# EAGLE design HB-Dis-EP-42BW (EAGLE 9.4.2)
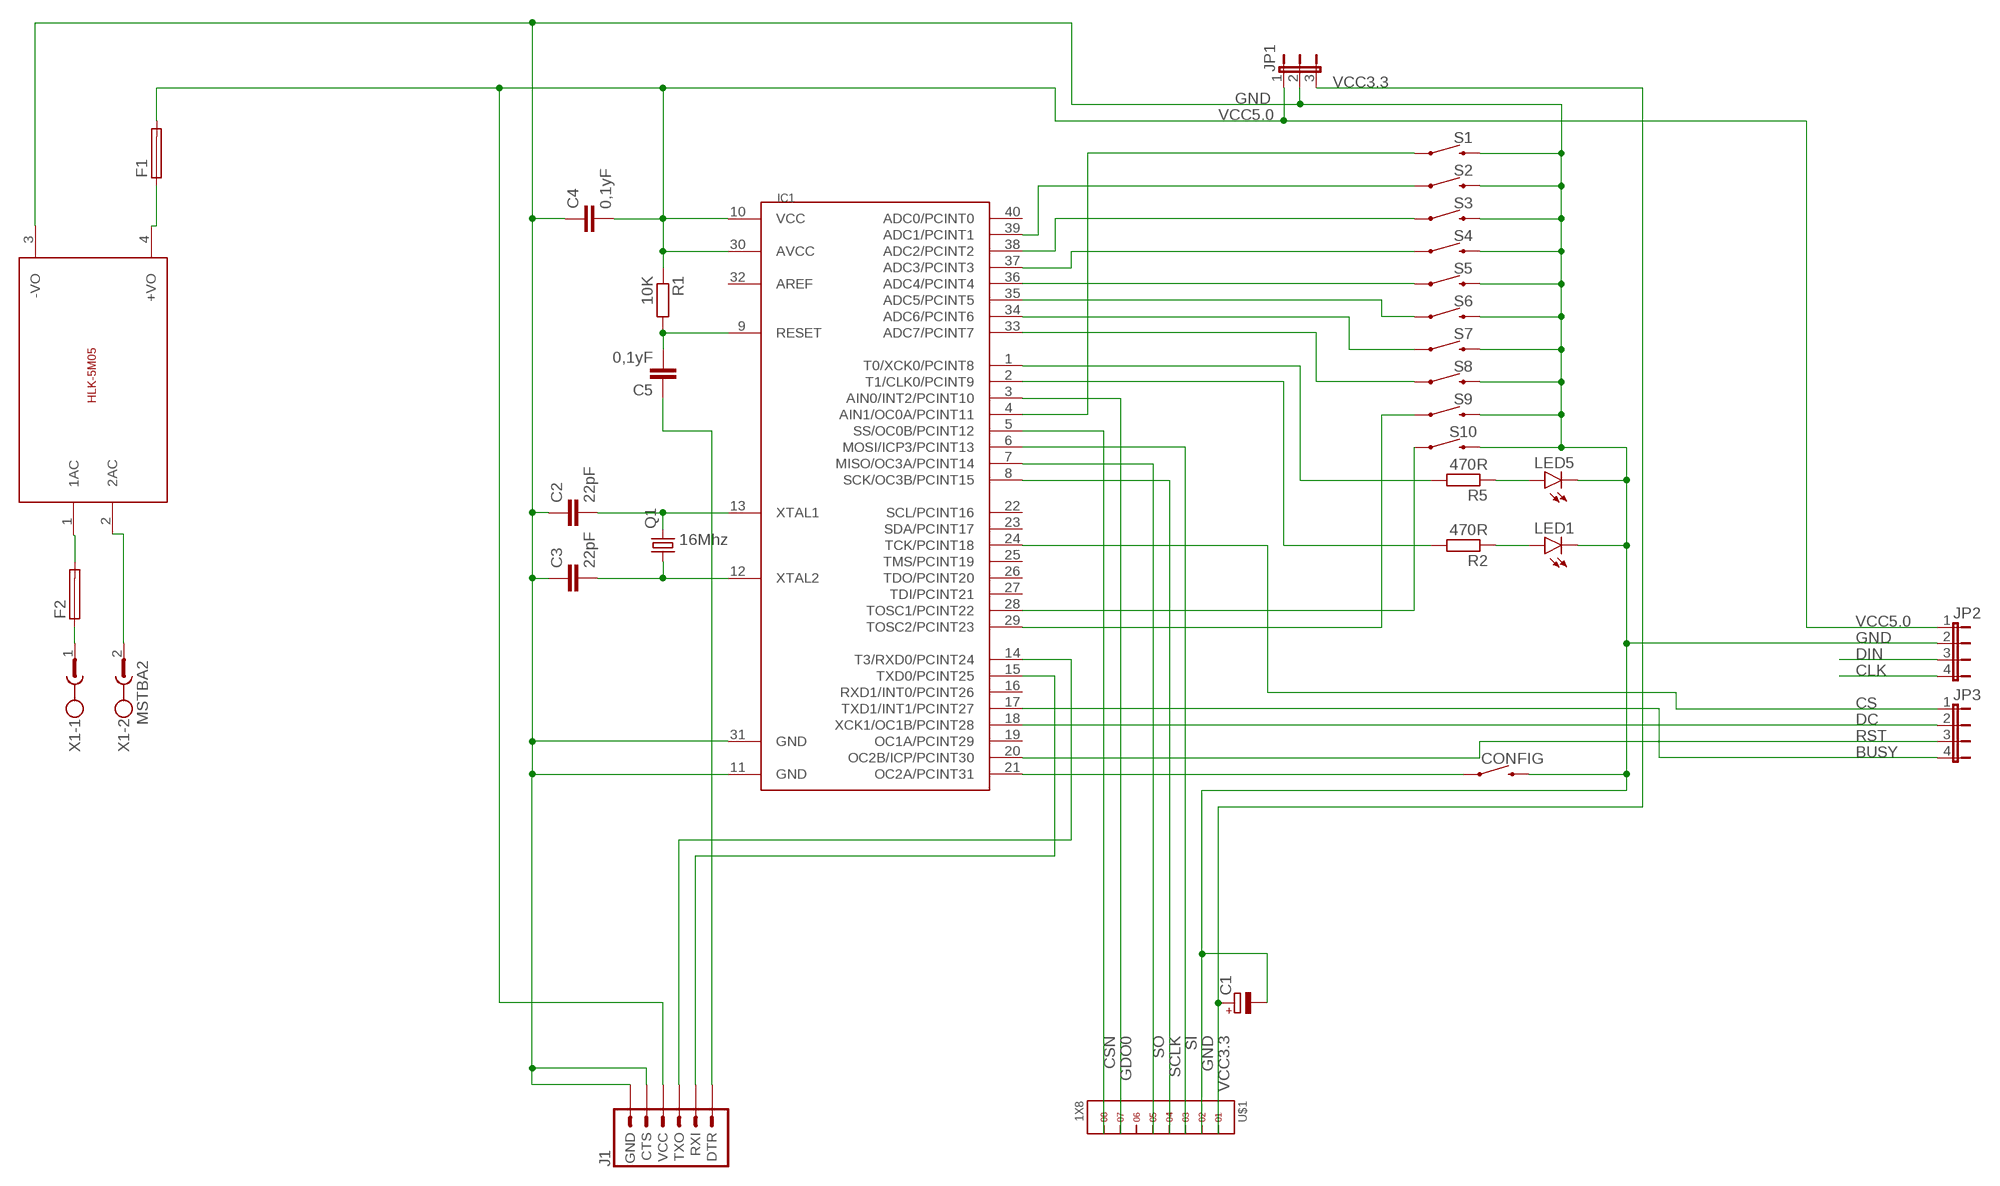
[diagram p0: schematic, sheet 1]

## Parts
C1  CPOL-EUE2.5-5  [E2,5-5]
C2  22pF  C-EU025-024X044  [C025-024X044]
C3  22pF  C-EU025-024X044  [C025-024X044]
C4  0,1yF  C-EU025-024X044  [C025-024X044]
C5  0,1yF  C-EU025-024X044  [C025-024X044]
CONFIG  MOMENTARY-SWITCH-SPST-PTH-6.0MM-KIT  [TACTILE_SWITCH_PTH_6.0MM_KIT]
F1  SH22,5A  [SH22,5A]
F2  SH22,5A  [SH22,5A]
IC1  MEGA1284P  [DIL40]
J1  6_PIN_SERIAL_TARGETLONGPADS  [1X06_LONGPADS]
JP1  JP2E  [JP2]
JP2  JP4E  [JP4]
JP3  JP4E  [JP4]
LED1  LED3MM  [LED3MM]
LED5  LED3MM  [LED3MM]
Q1  16Mhz  CRYSTALHC49U-V  [HC49U-V]
R1  10K  R-EU_0309/10  [0309/10]
R2  470R  R-EU_0309/10  [0309/10]
R5  470R  R-EU_0309/10  [0309/10]
S1  MOMENTARY-SWITCH-SPST-PTH-6.0MM-KIT  [TACTILE_SWITCH_PTH_6.0MM_KIT]
S2  MOMENTARY-SWITCH-SPST-PTH-6.0MM-KIT  [TACTILE_SWITCH_PTH_6.0MM_KIT]
S3  MOMENTARY-SWITCH-SPST-PTH-6.0MM-KIT  [TACTILE_SWITCH_PTH_6.0MM_KIT]
S4  MOMENTARY-SWITCH-SPST-PTH-6.0MM-KIT  [TACTILE_SWITCH_PTH_6.0MM_KIT]
S5  MOMENTARY-SWITCH-SPST-PTH-6.0MM-KIT  [TACTILE_SWITCH_PTH_6.0MM_KIT]
S6  MOMENTARY-SWITCH-SPST-PTH-6.0MM-KIT  [TACTILE_SWITCH_PTH_6.0MM_KIT]
S7  MOMENTARY-SWITCH-SPST-PTH-6.0MM-KIT  [TACTILE_SWITCH_PTH_6.0MM_KIT]
S8  MOMENTARY-SWITCH-SPST-PTH-6.0MM-KIT  [TACTILE_SWITCH_PTH_6.0MM_KIT]
S9  MOMENTARY-SWITCH-SPST-PTH-6.0MM-KIT  [TACTILE_SWITCH_PTH_6.0MM_KIT]
S10  MOMENTARY-SWITCH-SPST-PTH-6.0MM-KIT  [TACTILE_SWITCH_PTH_6.0MM_KIT]
U$1  1X8  [1X8]
U$3  5VDC/5W  HLK-5M05  [HLK-5M05]
X1  MSTBA2  [MSTBA2]

## Nets
BUSY: IC1.17(TXD1/INT1/PCINT27) JP3.4
CLK: JP2.4
CS: IC1.24(TCK/PCINT18) JP3.1
CSN: IC1.5(SS/OC0B/PCINT12) U$1.8
DC: IC1.18(XCK1/OC1B/PCINT28) JP3.2
DIN: JP2.3
GDO0: IC1.3(AIN0/INT2/PCINT10) U$1.7
GND: C1.- C2.1 C3.1 C4.1 CONFIG.3 IC1.11(GND) IC1.31(GND) J1.5(CTS) J1.6(GND) JP1.2 JP2.2 LED1.K(C) LED5.K(C) S1.3 S2.3 S3.3 S4.3 S5.3 S6.3 S7.3 S8.3 S9.3 S10.3 U$1.2 U$3.3(-VO)
N$1: C2.2 IC1.13(XTAL1) Q1.2
N$2: C3.2 IC1.12(XTAL2) Q1.1
N$3: C5.1 J1.1(DTR)
N$4: LED1.A R2.1
N$5: F2.1 X1.1
N$6: U$3.2(2AC) X1.2
N$7: F2.2 U$3.1(1AC)
N$8: F1.1 U$3.4(+VO)
N$9: C5.2 IC1.9(RESET) R1.2
N$10: IC1.15(TXD0/PCINT25) J1.2(RXI)
N$11: LED5.A R5.1
N$12: IC1.4(AIN1/OC0A/PCINT11) S1.1
N$13: IC1.14(T3/RXD0/PCINT24) J1.3(TXO)
N$19: IC1.39(ADC1/PCINT1) S2.1
N$20: IC1.38(ADC2/PCINT2) S3.1
N$21: IC1.37(ADC3/PCINT3) S4.1
N$22: IC1.36(ADC4/PCINT4) S5.1
N$23: IC1.35(ADC5/PCINT5) S6.1
N$24: IC1.34(ADC6/PCINT6) S7.1
N$25: IC1.33(ADC7/PCINT7) S8.1
N$26: IC1.28(TOSC1/PCINT22) S10.1
N$27: IC1.29(TOSC2/PCINT23) S9.1
N$28: CONFIG.1 IC1.21(OC2A/PCINT31)
N$29: IC1.1(T0/XCK0/PCINT8) R5.2
N$30: IC1.2(T1/CLK0/PCINT9) R2.2
RST: IC1.20(OC2B/ICP/PCINT30) JP3.3
SCLK: IC1.8(SCK/OC3B/PCINT15) U$1.4
SI: IC1.6(MOSI/ICP3/PCINT13) U$1.3
SO: IC1.7(MISO/OC3A/PCINT14) U$1.5
VCC3.3: C1.+ JP1.3 U$1.1
VCC5.0: C4.2 F1.2 IC1.10(VCC) IC1.30(AVCC) J1.4(VCC) JP1.1 JP2.1 R1.1
Unconnected: IC1.16(RXD1/INT0/PCINT26) IC1.19(OC1A/PCINT29) IC1.22(SCL/PCINT16) IC1.23(SDA/PCINT17) IC1.25(TMS/PCINT19) IC1.26(TDO/PCINT20) IC1.27(TDI/PCINT21) IC1.32(AREF) IC1.40(ADC0/PCINT0) U$1.6

## Library data of the parts
C1 = resistor:CPOL-EU: POLARIZED CAPACITOR, European symbol
C2-C5 = resistor:C-EU: CAPACITOR, European symbol
CONFIG S1-S10 = SparkFun-Switches:MOMENTARY-SWITCH-SPST: Momentary Switch (Pushbutton) - SPST Normally-open (NO) SPST momentary switches (buttons, pushbuttons). Variants PTH-12MM - 12mm square, through-hole Momentary Pushbutton Switch - 12mm Square <https://www.sparkfun.com/products/9190> (COM-09190) PTH-6.0MM, PTH-6.0MM-KIT - 6.0mm square, through-hole Mini Pushbutton Switch <https://www.sparkfun.com/products/97> (COM-00097) KIT package intended for soldering kit's - only one side of pads' copper is exposed. PTH-RIGHT-ANGLE-KIT - Right-angle, through-hole Right Angle Tactile Button <https://www.sparkfun.com/products/10791> - Used on SparkFun BigTime Watch Kit <https://www.sparkfun.com/products/11734> SMD-12MM - 12mm square, surface-mount Tactile Button - SMD (12mm) <https://www.sparkfun.com/products/12993> (COM-12993) Used on SparkFun PicoBoard <https://www.sparkfun.com/products/11888> SMD-4.5MM - 4.5mm Square Trackball Switch Used on SparkFun Blackberry Trackballer Breakout <https://www.sparkfun.com/products/13169> SMD-4.6MMX2.8MM - 4.60mm x 2.80mm, surface mount Used on SparkFun SAMD21 Mini Breakout <https://www.sparkfun.com/products/13664> SMD-5.2MM, SMD-5.2-REDUNDANT - 5.2mm square, surface-mount Mini Pushbutton Switch - SMD <https://www.sparkfun.com/products/8720> (COM-08720) Used on Arduino Pro Mini <https://www.sparkfun.com/products/11114> REDUNDANT package connects both switch circuits together SMD-6.0X3.5MM - 6.0 x 3.5mm, surface mount Momentary Reset Switch SMD <https://www.sparkfun.com/products/8229> (COM-08229) SMD-6.2MM-TALL - 6.2mm square, surface mount Tactile Button - SMD (6mm) <https://www.sparkfun.com/products/12992> Used on SparkFun Digital Sandbox <https://www.sparkfun.com/products/12651> SMD-RIGHT-ANGLE - Right-angle, surface mount Used on SparkFun Block for Intel® Edison - Arduino <https://www.sparkfun.com/products/13036>; PROD_ID: SWCH-08441; SF_SKU: COM-00097
F1 F2 = fuse:SH22,5A: FUSE HOLDER grid 22,5mm, isolated cap OGN0031 8201, Schurter (Buerklin); MPN: 0031.7701.11; OC_FARNELL: unknown; OC_NEWARK: 04F1224
IC1 = 1284p:MEGA1284P: Atmel ATmega1284P 8-bit AVR Microcontroller
J1 = SparkFun-Connectors:6_PIN_SERIAL_TARGET: 6-pin header connection for use with the "FTDI BASIC" pinout - TARGET SIDE. Also known as "Arduino Serial Program Header". It is used to mate with our FTDI Basic serial programmers using the Arduino IDE. Note, this device has "TARGET" in the name. It is intended to be used on a design that contains a target micro-controller that you wish to program. The "sister" device, named "CABLE" is inteneded to be used on a design that usually lives on the end of your USB cable and prvides the converter chip (FTDI232 or FTDI231x) to commnicate serial RX/TX. You can populate with some of these: Break Away Headers - Straight <https://www.sparkfun.com/products/116> (PRT-00116) For reference (or to suit your programming needs) check out these designs: SparkFun FTDI Basic Breakout - 5V <https://www.sparkfun.com/products/9716> (DEV-09716) SparkFun FTDI Basic Breakout - 3.3V <https://www.sparkfun.com/products/9873> (DEV-09873) SparkFun FTDI SmartBasic <https://www.sparkfun.com/products/12935> (DEV-12935) SparkFun Beefy 3 - FTDI Basic Breakout <https://www.sparkfun.com/products/13746> (DEV-13746)
JP1 = jumper:JP2E: JUMPER
JP2 JP3 = jumper:JP4E: JUMPER
LED1 LED5 = led:LED: LED OSRAM: - CHIPLED LG R971, LG N971, LY N971, LG Q971, LY Q971, LO R971, LY R971 LH N974, LH R974 LS Q976, LO Q976, LY Q976 LO Q996 - Hyper CHIPLED LW Q18S LB Q993, LB Q99A, LB R99A - SideLED LS A670, LO A670, LY A670, LG A670, LP A670 LB A673, LV A673, LT A673, LW A673 LH A674 LY A675 LS A676, LA A676, LO A676, LY A676, LW A676 LS A679, LY A679, LG A679 - Hyper Micro SIDELED® LS Y876, LA Y876, LO Y876, LY Y876 LT Y87S - SmartLED LW L88C, LW L88S LB L89C, LB L89S, LG L890 LS L89K, LO L89K, LY L89K LS L896, LA L896, LO L896, LY L896 - TOPLED LS T670, LO T670, LY T670, LG T670, LP T670 LSG T670, LSP T670, LSY T670, LOP T670, LYG T670 LG T671, LOG T671, LSG T671 LB T673, LV T673, LT T673, LW T673 LH T674 LS T676, LA T676, LO T676, LY T676, LB T676, LH T676, LSB T676, LW T676 LB T67C, LV T67C, LT T67C, LS T67K, LO T67K, LY T67K, LW E67C LS E67B, LA E67B, LO E67B, LY E67B, LB E67C, LV E67C, LT E67C LW T67C LS T679, LY T679, LG T679 LS T770, LO T770, LY T770, LG T770, LP T770 LB T773, LV T773, LT T773, LW T773 LH T774 LS E675, LA E675, LY E675, LS T675 LS T776, LA T776, LO T776, LY T776, LB T776 LHGB T686 LT T68C, LB T68C - Hyper Mini TOPLED® LB M676 - Mini TOPLED Santana® LG M470 LS M47K, LO M47K, LY M47K Source: http://www.osram.convergy.de LUXEON: - LUMILED® LXK2-PW12-R00, LXK2-PW12-S00, LXK2-PW14-U00, LXK2-PW14-V00 LXK2-PM12-R00, LXK2-PM12-S00, LXK2-PM14-U00 LXK2-PE12-Q00, LXK2-PE12-R00, LXK2-PE12-S00, LXK2-PE14-T00, LXK2-PE14-U00 LXK2-PB12-K00, LXK2-PB12-L00, LXK2-PB12-M00, LXK2-PB14-N00, LXK2-PB14-P00, LXK2-PB14-Q00 LXK2-PR12-L00, LXK2-PR12-M00, LXK2-PR14-Q00, LXK2-PR14-R00 LXK2-PD12-Q00, LXK2-PD12-R00, LXK2-PD12-S00 LXK2-PH12-R00, LXK2-PH12-S00 LXK2-PL12-P00, LXK2-PL12-Q00, LXK2-PL12-R00 Source: www.luxeon.com KINGBRIGHT: KA-3528ASYC Source: www.kingbright.com
Q1 = crystal:CRYSTAL: CRYSTAL; OC_FARNELL: 1666969; OC_NEWARK: unknown
R1 R2 R5 = resistor:R-EU_: RESISTOR, European symbol
U$1 = headers(2mm):1X8
U$3 = HLK-5M05:HLK-5M05: HLK-5M05 is an 5Volt/5W smps developed by HI-LINK; SIZE: 23x38(mm)
X1 = con-phoenix-508:MSTBA2: PHOENIX; MF: FARNELL; MPN: 1757242; OC_FARNELL: 3705171; OC_NEWARK: 71C4161

## Board
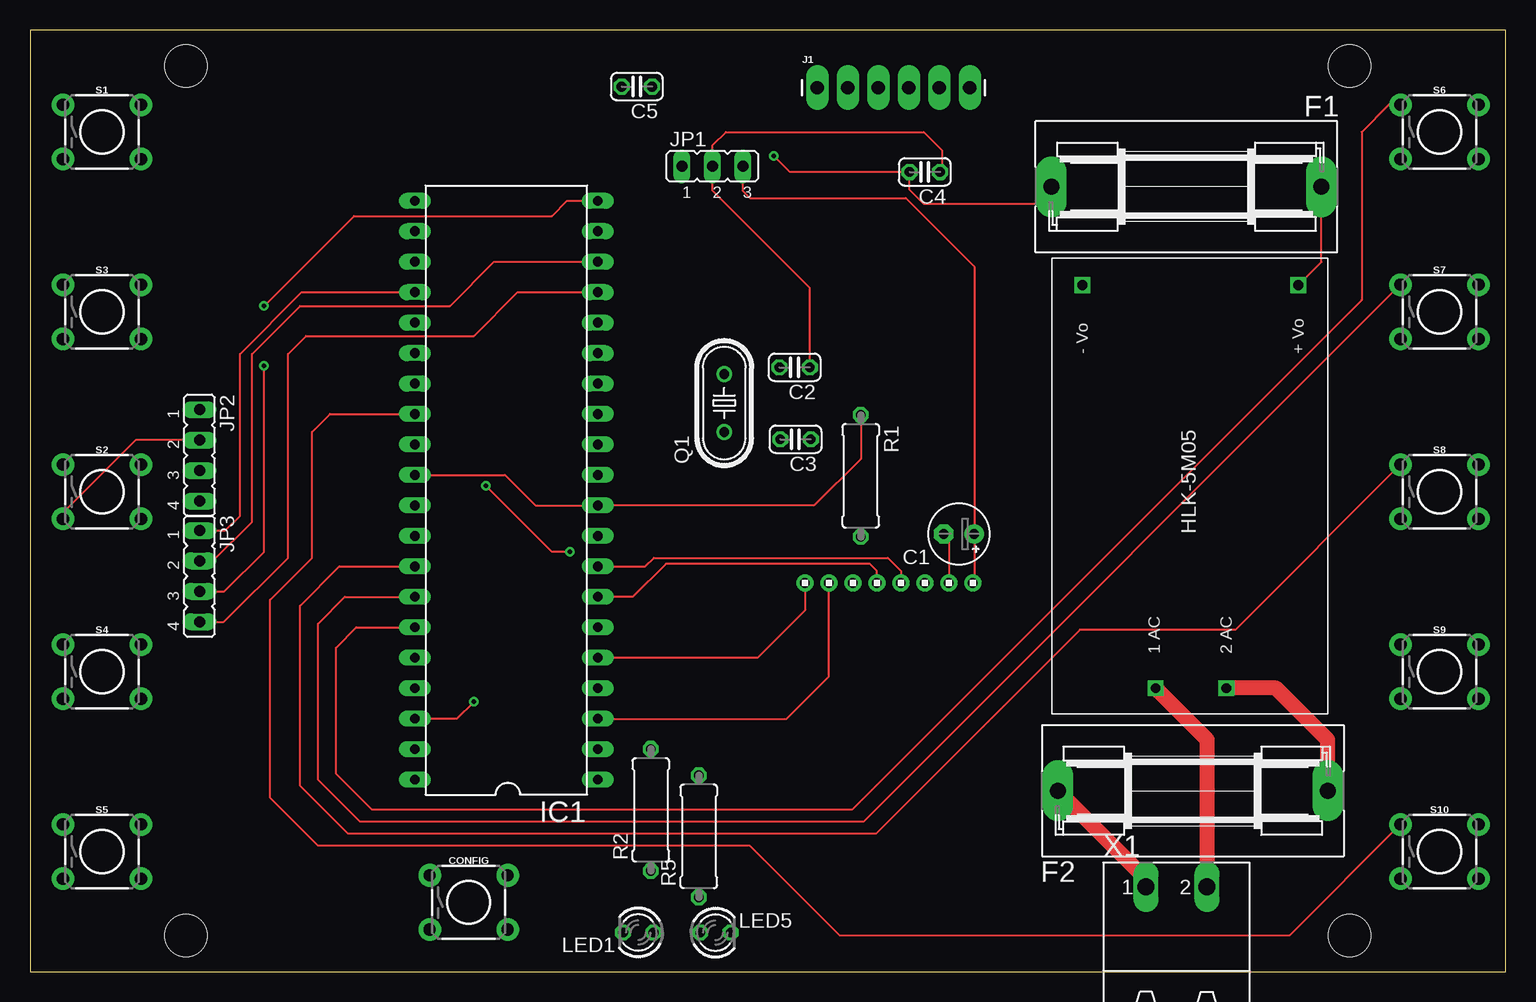
[diagram p1: board, top side]
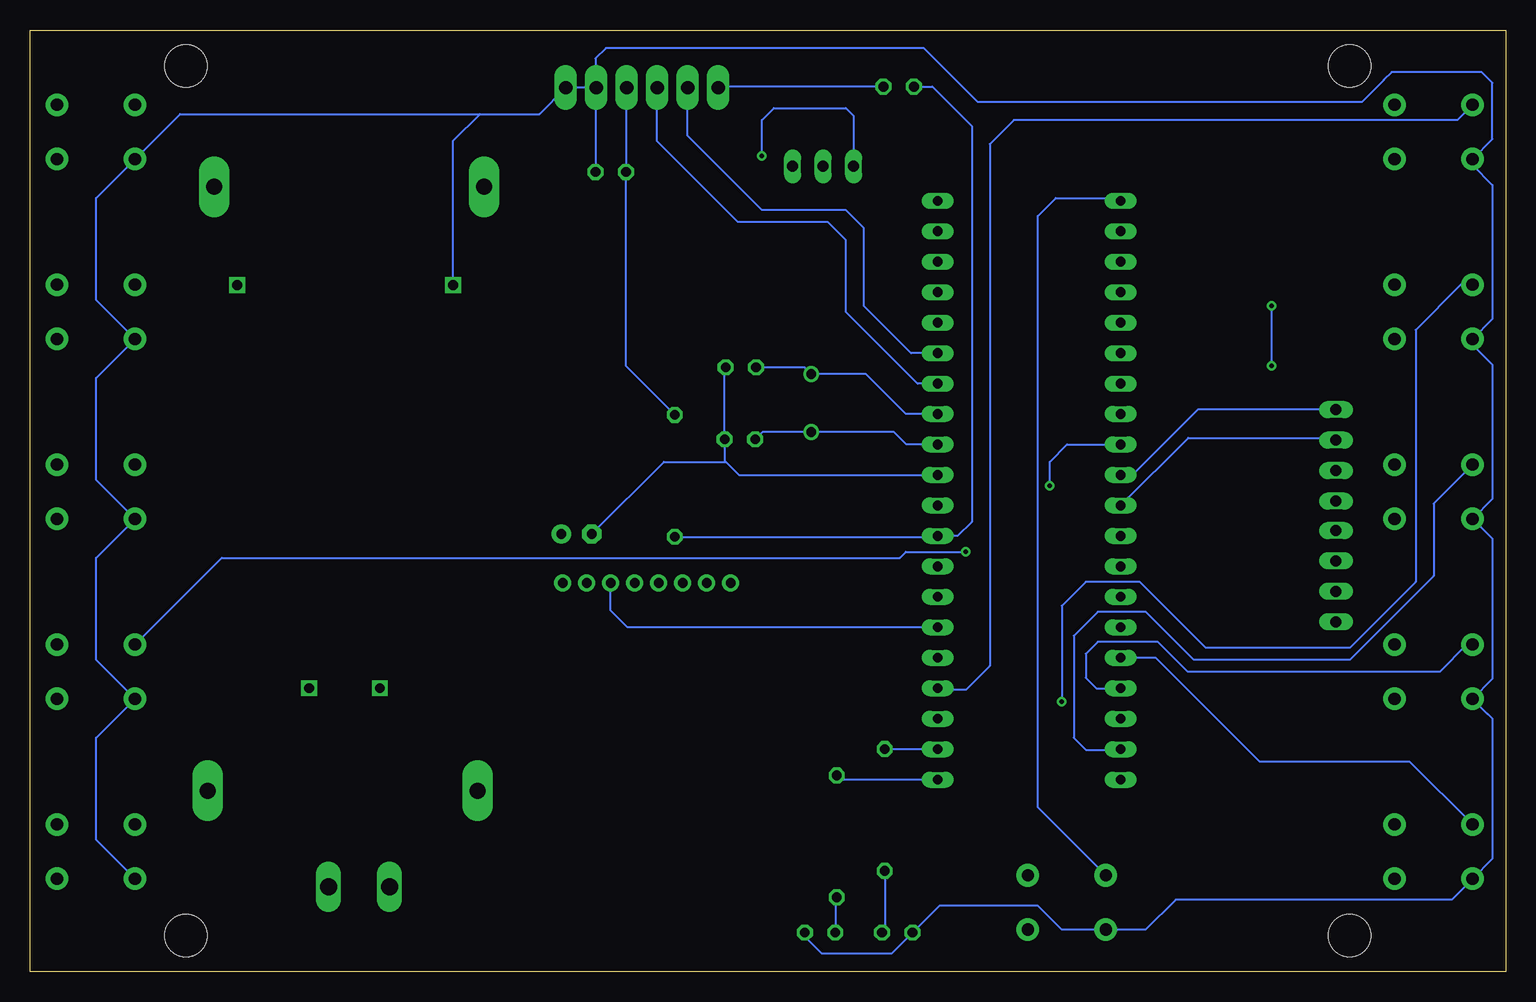
[diagram p2: board, bottom side, seen from below]

Size 123 x 78.5 mm. Coordinates in mm from the lower left corner, seen from the top.
Outline: 0,0 123,0 123,78.5 0,78.5 0,0
Copper layers (1*16): Top 0.035mm / dielectric 1.5mm / Bottom 0.035mm
Design rules "default": minimum track width 6mil, minimum drill 0.35mm, track to track 6mil, track to pad 6mil, pad to pad 6mil, via to via 6mil, smd to smd 6mil, copper to edge 40mil, drill to drill 6mil, minimum pad ring 10mil, minimum via ring 8mil, stop-mask expansion 4mil, vias tented up to drill 0mil, thermal gap 10mil
Holes 3.5 mm at 13,3 110,3 13,75.5 110,75.5

### Footprints (pad centres in the part's own frame; a part is rotated, then mirrored left to right if it is on the bottom)
E2,5-5 = drill 0.813 pad 1.6: + -1.27,0 | drill 0.813 pad 1.6 octagon: - 1.27,0
C025-024X044 = drill 0.813 octagon: 1 -1.27,0; 2 1.27,0
TACTILE_SWITCH_PTH_6.0MM_KIT = drill 1.016 pad 1.88: 1 -3.251,2.261; 2 3.251,2.261; 3 -3.251,-2.261; 4 3.251,-2.261
SH22,5A = drill 1.321 pad 2.54 long: 1 -11.252,0; 2 11.252,0
DIL40 = drill 0.813 long: 1 -24.13,-7.62; 2 -21.59,-7.62; 3 -19.05,-7.62; 4 -16.51,-7.62; 5 -13.97,-7.62; 6 -11.43,-7.62; 7 -8.89,-7.62; 8 -6.35,-7.62; 9 -3.81,-7.62; 10 -1.27,-7.62; 11 1.27,-7.62; 12 3.81,-7.62; 13 6.35,-7.62; 14 8.89,-7.62; 15 11.43,-7.62; 16 13.97,-7.62; 17 16.51,-7.62; 18 19.05,-7.62; 19 21.59,-7.62; 20 24.13,-7.62; 21 24.13,7.62; 22 21.59,7.62; 23 19.05,7.62; 24 16.51,7.62; 25 13.97,7.62; 26 11.43,7.62; 27 8.89,7.62; 28 6.35,7.62; 29 3.81,7.62; 30 1.27,7.62; 31 -1.27,7.62; 32 -3.81,7.62; 33 -6.35,7.62; 34 -8.89,7.62; 35 -11.43,7.62; 36 -13.97,7.62; 37 -16.51,7.62; 38 -19.05,7.62; 39 -21.59,7.62; 40 -24.13,7.62
1X06_LONGPADS = drill 1.118 pad 1.88 long: 1 0,0; 2 2.54,0; 3 5.08,0; 4 7.62,0; 5 10.16,0; 6 12.7,0
JP2 = drill 0.914 long: 1 -2.54,0; 2 0,0; 3 2.54,0
JP4 = drill 0.914 long: 1 -3.81,0; 2 -1.27,0; 3 1.27,0; 4 3.81,0
LED3MM = drill 0.813 octagon: A -1.27,0; K 1.27,0
HC49U-V = drill 0.813: 1 -2.413,0; 2 2.413,0
0309/10 = drill 0.813 octagon: 1 -5.08,0; 2 5.08,0
1X8 = drill 0.8 pad 1.422: 1 -7,0; 2 -5,0; 3 -3,0; 4 -1,0; 5 1,0; 6 3,0; 7 5,0; 8 7,0
HLK-5M05 = drill 0.8 square: 1 -16.85,-2.93; 2 -16.85,2.97; 3 16.75,9.07; 4 16.75,-8.93
MSTBA2 = drill 1.397 long: 1 -2.54,5.08; 2 2.54,5.08

### Placement (x,y rotation side)
C1  77.44,36.48 180 top
C2  63.74,50.37 180 top
C3  63.82,44.37 180 top
C4  74.59,66.66 180 top
C5  50.59,73.78 180 top
CONFIG  36.57,5.76 0 top
F1  96.4,65.43 180 top
F2  96.93,15.07 0 top
IC1  39.71,40.13 90 top
J1  65.64,73.69 0 top
JP1  56.88,67.13 0 top
JP2  14.13,43.03 270 top
JP3  14.13,32.96 270 top
LED1  50.7,3.25 180 top
LED5  57.14,3.25 0 top
Q1  57.87,47.4 90 top
R1  69.25,41.33 270 top
R2  51.75,13.47 90 top
R5  55.75,11.27 90 top
S1  6,70 0 top
S2  6,40 0 top
S3  6,55 0 top
S4  6,25 0 top
S5  6,10 0 top
S6  117.5,70 0 top
S7  117.5,55 0 top
S8  117.5,40 0 top
S9  117.5,25 0 top
S10  117.5,10 0 top
U$1  71.59,32.4 180 top
U$3  96.8,40.48 90 top
X1  95.57,1.98 0 top

### Tracks (layer width: path | path; a pad name or v marks a point on that pad's centre or on a via)
BUSY
  Top 0.152: JP3.4 16.15,29.15 21.5,34.5 21.5,51.5 23,53 37,53 40.64,56.64 IC1.17
CS
  Top 0.152: JP3.1 16.27,36.77 17.5,38 17.5,51.5 22.64,56.64 IC1.24
CSN
  Top 0.152: U$1.8 64.59,30.09 60.66,26.16 IC1.5
DC
  Top 0.152: JP3.2 15.23,34.23 18.5,37.5 18.5,51.5 22.5,55.5 35,55.5 38.68,59.18 IC1.18
GDO0
  Top 0.152: IC1.3 63.08,21.08 66.59,24.59 U$1.7
GND
  Top 0.152: JP2.2 8.8,44.3 2.75,38.25 S2.3 | C2.1 65.01,56.99 56.88,65.12 JP1.2 56.88,68.88 58,70 74.5,70 76,68.5 76,66.8 C4.1 | C1.- 76.59,36.06 U$1.2
  Bottom 0.152: LED5.K 58.41,2.91 57,1.5 51.18,1.5 LED1.K 47.18,5.5 39,5.5 37,3.5 CONFIG.3 30,3.5 27.5,6 4.49,6 S5.3 1.09,9.4 1.09,21.09 1.5,21.5 1.51,21.5 S4.3 1.09,24.4 1.09,36.09 S2.3 1.09,39.4 1.09,50.59 2.75,52.25 S3.3 1.09,54.4 1.09,65.58 2.75,67.24 S1.3 1.09,69.4 1.09,74.09 2,75 9.5,75 10.16,74.34 10.16,74.32 11.98,72.5 44,72.5 48.5,77 75,77 75.86,76.14 75.86,73.63 | IC1.31 26.45,44.5 14.33,44.5 JP2.2 | 75.86,73.63 J1.5 J1.6 80.53,71.5 85.5,71.5 | 75.86,73.63 C4.1 | C2.1 65.09,50.29 C3.1 65.09,42.59 65,42.5 | IC1.11 63.9,41.4 65,42.5 | C1.- 70.15,42.5 65,42.5 | S10.3 117.5,11 117.5,19.49 S9.3 117.5,25.99 117.5,34.49 S8.3 117.5,40.99 117.5,49.49 S7.3 117.5,55.99 117.5,64.49 S6.3 110.49,71.5 85.5,71.5 | U$3.3 87.73,69.27 85.5,71.5
N$1
  Bottom 0.152: IC1.13 47.35,46.5 50,46.5 53.31,49.81 Q1.2 58.43,50.37 C2.2
N$2
  Bottom 0.152: IC1.12 49.94,43.94 50.99,44.99 Q1.1 61.93,44.99 C3.2
N$3
  Bottom 0.152: C5.1 65.55,73.78 J1.1
N$4
  Bottom 0.152: R2.1 51.75,3.47 LED1.A
N$5
  Top 1.27: F2.1 93.03,7.72 X1.1
N$6
  Top 1.27: U$3.2 98.11,19.35 X1.2
N$7
  Top 1.27: F2.2 108.18,19.32 103.87,23.63 U$3.1
N$8
  Top 0.152: U$3.4 107.65,59.15 F1.1
N$9
  Bottom 0.152: C5.2 47.78,73.78 44.5,70.5 44.5,37.5 45.68,36.32 IC1.9 47.4,36.25 R1.2
N$10
  Bottom 0.152: IC1.15 49.56,51.56 53.5,55.5 53.5,62 55,63.5 62,63.5 68.18,69.68 J1.2
N$11
  Bottom 0.152: R5.1 55.87,6.07 LED5.A
N$12
  Bottom 0.152: S1.1 4.01,71 41,71 43,69 43,25.5 45,23.5 47.21,23.5 IC1.4
N$13
  Bottom 0.152: IC1.14 49.02,49.02 55,55 55,61 56.5,62.5 64,62.5 70.72,69.22 J1.3
N$19
  Bottom 0.152: S2.1 6,39.01 6,33 13,26 26,26 30,30 34,30 36,28 36,19.5 35,18.5 32.13,18.5 IC1.39
N$20  (via drill 0.35)
  Top 0.152: v37,22.5 35.58,21.08 IC1.38
  Bottom 0.152: S3.1 3.74,57.26 7.5,53.5 7.5,32.5 13,27 25,27 30.5,32.5 35,32.5 37,30.5 v37,22.5
N$21
  Bottom 0.152: S4.1 3.24,27.26 5.5,25 26.5,25 29,27.5 34,27.5 35,26.5 35,24.5 34.12,23.62 IC1.37
N$22
  Bottom 0.152: S5.1 7.99,17.5 20.5,17.5 29.16,26.16 IC1.36
N$23
  Top 0.152: S6.1 113.26,72.26 111,70 111,56 68.5,13.5 28.5,13.5 25.5,16.5 25.5,27 27.2,28.7 IC1.35
N$24
  Top 0.152: S7.1 69.49,12.5 27.5,12.5 24,16 24,29 26.24,31.24 IC1.34
N$25
  Top 0.152: S8.1 100.49,28.5 87.5,28.5 70.5,11.5 26.5,11.5 22.5,15.5 22.5,30.5 25.78,33.78 IC1.33
N$26
  Top 0.152: S10.1 104.99,3 67.5,3 60,10.5 24,10.5 20,14.5 20,31 23.5,34.5 23.5,45 25,46.5 32.07,46.5 IC1.28
N$27  (via drill 0.35)
  Top 0.152: v45,35 43.5,35 v38,40.5
  Bottom 0.152: S9.1 107.01,34.5 50.5,34.5 50,35 v45,35 | v38,40.5 38,42.5 36.56,43.94 IC1.29
N$28
  Bottom 0.152: CONFIG.1 39,13.7 39,63 37.5,64.5 32.33,64.5 IC1.21
N$29
  Bottom 0.152: IC1.1 55.4,16 R5.2
N$30
  Bottom 0.152: IC1.2 R2.2
RST  (via drill 0.35)
  Top 0.152: JP3.3 16.19,31.69 19.5,35 v19.5,50.5 | v19.5,55.5 27,63 43.5,63 44.76,64.26 IC1.20
  Bottom 0.152: v19.5,50.5 v19.5,55.5
SCLK
  Top 0.152: IC1.8 51.28,33.78 52,34.5 71.5,34.5 72.59,33.41 U$1.4
SI
  Bottom 0.152: IC1.6 73.2,28.7 74.59,30.09 U$1.3
SO
  Top 0.152: U$1.5 70.59,33.41 70,34 53,34 50.24,31.24 IC1.7
VCC3.3
  Top 0.152: U$1.1 78.71,32.52 C1.+ 78.71,58.79 73,64.5 60,64.5 59.42,65.08 JP1.3
VCC5.0  (via drill 0.35)
  Top 0.152: R1.1 69.25,42.75 65.36,38.86 IC1.10 42.14,38.86 39.6,41.4 IC1.30 | F1.2 83.72,64 74.5,64 73.32,65.18 C4.2 63.34,66.66 v62,68
  Bottom 0.152: J1.4 73.32,73.63 C4.2 73.32,50.48 R1.1 | v62,68 62,71 61,72 55,72 54.34,71.34 JP1.1 | JP2.1 25.66,46.84 31.1,41.4 IC1.30